# EAGLE design PowerDist (EAGLE 9.6.2)
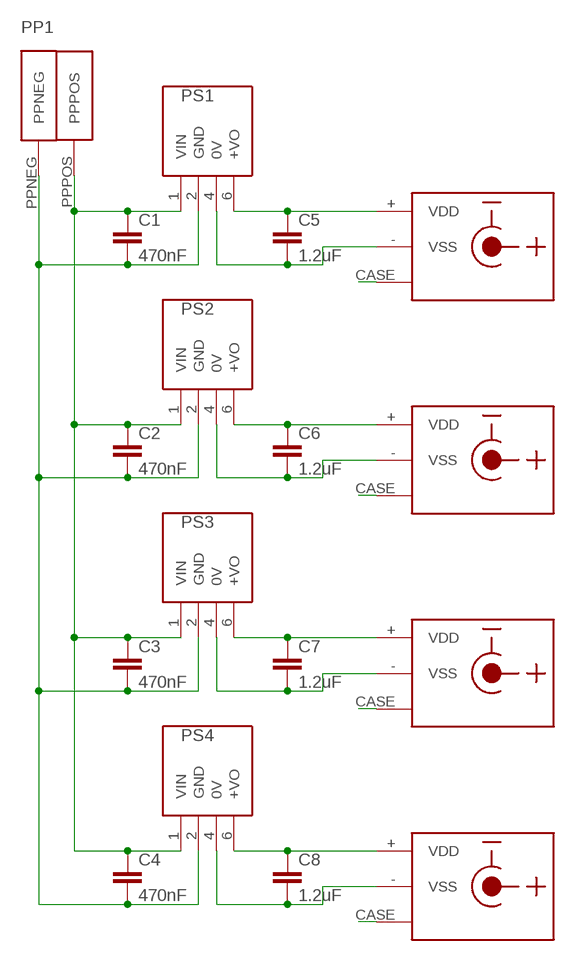
[diagram p0: schematic, sheet 1]

## Parts
C1  470nF  C5/2.5  [C5B2.5]
C2  470nF  C5/2.5  [C5B2.5]
C3  470nF  C5/2.5  [C5B2.5]
C4  470nF  C5/2.5  [C5B2.5]
C5  1.2uF  C2,5-3  [C2.5-3]
C6  1.2uF  C2,5-3  [C2.5-3]
C7  1.2uF  C2,5-3  [C2.5-3]
C8  1.2uF  C2,5-3  [C2.5-3]
PP1  POWER_POLES_WINGS  [POWERPOLE_PAIR_WINGS]
PS1  PRMCE1-S12-S15-S  [PRMCE1S12S15S]
PS2  PRMCE1-S12-S15-S  [PRMCE1S12S15S]
PS3  PRMCE1-S12-S15-S  [PRMCE1S12S15S]
PS4  PRMCE1-S12-S15-S  [PRMCE1S12S15S]
U$1  CUI_PJ-102A  [CUI_DCJACK_PCB]
U$2  CUI_PJ-102A  [CUI_DCJACK_PCB]
U$3  CUI_PJ-102A  [CUI_DCJACK_PCB]
U$4  CUI_PJ-102A  [CUI_DCJACK_PCB]

## Nets
CASE: U$1.CASE
CASE1: U$2.CASE
CASE2: U$3.CASE
CASE3: U$4.CASE
N$1: C1.1 C2.1 C3.1 C4.1 PP1.PPPOS PS1.1(VIN) PS2.1(VIN) PS3.1(VIN) PS4.1(VIN)
N$2: C1.2 C2.2 C3.2 C4.2 PP1.PPNEG PS1.2(GND) PS2.2(GND) PS3.2(GND) PS4.2(GND)
N$3: C5.1 PS1.6(+VO) U$1.+(VDD)
N$4: C6.1 PS2.6(+VO) U$2.+(VDD)
N$5: C7.1 PS3.6(+VO) U$3.+(VDD)
N$6: C8.1 PS4.6(+VO) U$4.+(VDD)
N$7: C5.2 PS1.4(0V) U$1.-(VSS)
N$8: C6.2 PS2.4(0V) U$2.-(VSS)
N$9: C7.2 PS3.4(0V) U$3.-(VSS)
N$10: C8.2 PS4.4(0V) U$4.-(VSS)

## Library data of the parts
C1-C8 = capacitor-wima:C: CAPACITOR naming: grid - package width
PP1 = cwParts:POWER_POLES_WINGS: Dual powerpoles for voltage supply with mounting wings.
PS1-PS4 = SamacSys_Parts:PRMCE1-S12-S15-S: Isolated DC/DC Converters dc-dc isolated 3k, 1 W, 11.4 12.6 Vdc input, 15 Vdc, 67 mA, single regulated output, SIP Source: Datasheet <https://www.cui.com/product/resource/pdf/prmce1-s.pdf>; DESCRIPTION: Isolated DC/DC Converters dc-dc isolated 3k, 1 W, 11.4 12.6 Vdc input, 15 Vdc, 67 mA, single regulated output, SIP; HEIGHT: 10.41mm; MANUFACTURER_NAME: CUI Inc.; MANUFACTURER_PART_NUMBER: PRMCE1-S12-S15-S; MOUSER_PART_NUMBER: 490-PRMCE1-S12-S15-S; MOUSER_PRICE-STOCK: https://www.mouser.co.uk/ProductDetail/CUI-Inc/PRMCE1-S12-S15-S?qs=7D1LtPJG0i3eC5LUP4Wtzw%3D%3D
U$1-U$4 = con-dc-jack:CUI_PJ-102A

## Board
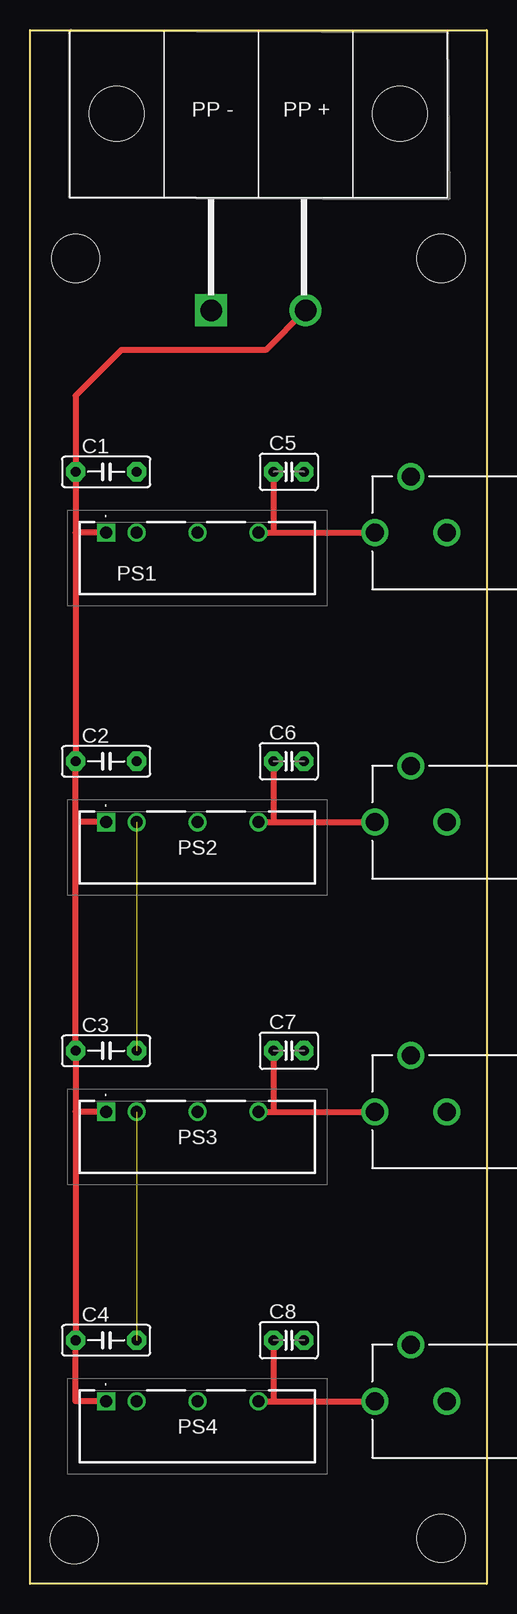
[diagram p1: board, top side]
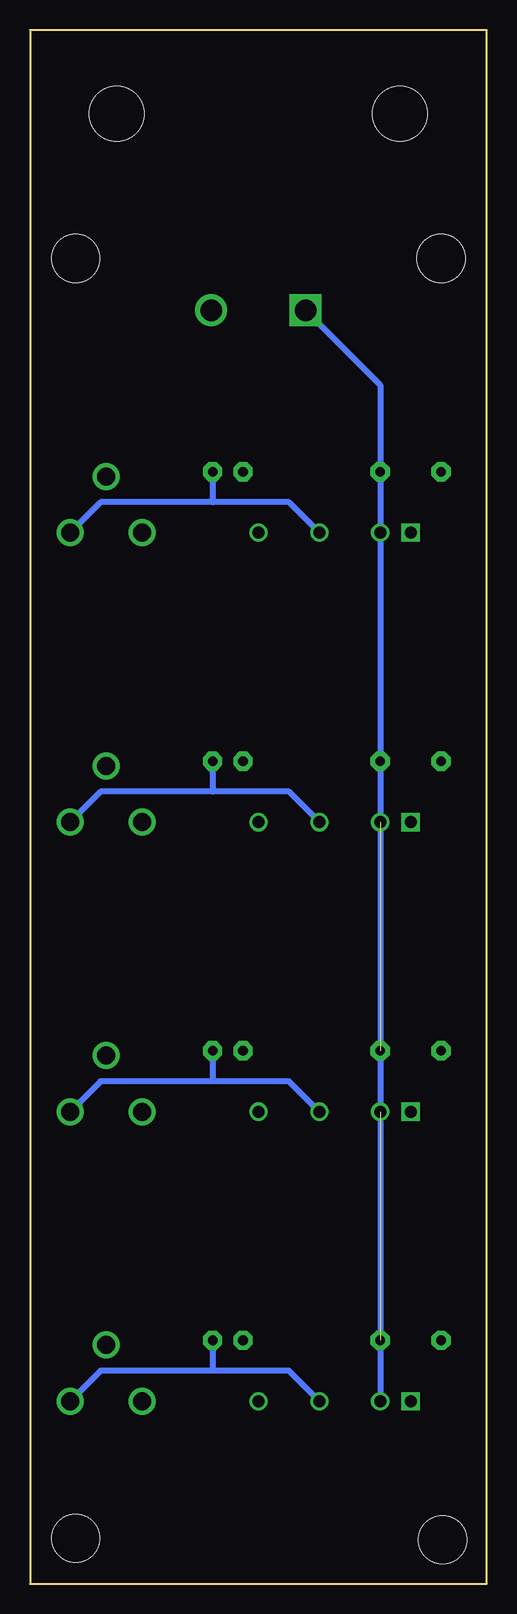
[diagram p2: board, bottom side, seen from below]

Size 38.1 x 129.54 mm. Coordinates in mm from the lower left corner, seen from the top.
Outline: 0,0 0,129.54 38.1,129.54 38.1,0 0,0
Copper layers (1*16): Top 0.035mm / dielectric 1.5mm / Bottom 0.035mm
Design rules "default": minimum track width 6mil, minimum drill 0.35mm, track to track 6mil, track to pad 6mil, pad to pad 6mil, via to via 6mil, smd to smd 6mil, copper to edge 40mil, drill to drill 6mil, minimum pad ring 10mil, minimum via ring 8mil, stop-mask expansion 4mil, vias tented up to drill 0mil, thermal gap 10mil
Holes 4 mm at 3.68,3.68 34.29,3.81 34.29,110.49 3.81,110.49

### Footprints (pad centres in the part's own frame; a part is rotated, then mirrored left to right if it is on the bottom)
C5B2.5 = drill 0.813 pad 1.6 octagon: 1 -2.54,0; 2 2.54,0
C2.5-3 = drill 0.813 pad 1.6 octagon: 1 -1.27,0; 2 1.27,0
POWERPOLE_PAIR_WINGS = drill 1.778 square: PPNEG -3.937,-23.368 | drill 1.778: PPPOS 3.937,-23.368 | hole 4.572: -11.811,-6.985; 11.811,-6.985
PRMCE1S12S15S = drill 1 pad 1.5 square: 1 0,0 | drill 1 pad 1.5: 2 2.54,0; 4 7.62,0; 6 12.7,0
CUI_DCJACK_PCB = drill 1.5: + -3,0; - 3,0; CASE 0,4.7

### Placement (x,y rotation side)
C1  6.35,92.71 0 top
C2  6.35,68.58 0 top
C3  6.35,44.45 0 top
C4  6.35,20.32 0 top
C5  21.59,92.71 0 top
C6  21.59,68.58 0 top
C7  21.59,44.45 0 top
C8  21.59,20.32 0 top
PP1  19.05,129.54 0 top
PS1  6.35,87.63 0 top
PS2  6.35,63.5 0 top
PS3  6.35,39.37 0 top
PS4  6.35,15.24 0 top
U$1  31.75,87.63 0 top
U$2  31.75,63.5 0 top
U$3  31.75,39.37 0 top
U$4  31.75,15.24 0 top

### Tracks (layer width: path | path; a pad name or v marks a point on that pad's centre or on a via)
N$1
  Top 0.508: PP1.PPPOS 19.68,102.87 7.62,102.87 3.81,99.06 C1.1 3.81,87.63 | 3.81,87.63 C2.1 3.81,63.5 | 3.81,63.5 C3.1 3.81,39.37 | 3.81,39.37 C4.1 3.81,15.24 PS4.1 | PS1.1 3.81,87.63 | PS2.1 3.81,63.5 | PS3.1 3.81,39.37
N$2  (2 unrouted)
  Bottom 0.508: PP1.PPNEG 8.89,99.95 C1.2 PS1.2 C2.2 PS2.2 C3.2 PS3.2 C4.2 PS4.2
N$3
  Top 0.508: PS1.6 20.32,87.63 | 20.32,87.63 U$1.+ | C5.1 20.32,87.63
N$4
  Top 0.508: PS2.6 20.32,63.5 | 20.32,63.5 U$2.+ | C6.1 20.32,63.5
N$5
  Top 0.508: PS3.6 20.32,39.37 | 20.32,39.37 U$3.+ | C7.1 20.32,39.37
N$6
  Top 0.508: PS4.6 20.32,15.24 | 20.32,15.24 U$4.+ | C8.1 20.32,15.24
N$7
  Bottom 0.508: PS1.4 16.51,90.17 22.86,90.17 | 22.86,90.17 32.21,90.17 U$1.- | C5.2 22.86,90.17
N$8
  Bottom 0.508: PS2.4 16.51,66.04 22.86,66.04 | 22.86,66.04 32.21,66.04 U$2.- | C6.2 22.86,66.04
N$9
  Bottom 0.508: PS3.4 16.51,41.91 22.86,41.91 | 22.86,41.91 32.21,41.91 U$3.- | C7.2 22.86,41.91
N$10
  Bottom 0.508: PS4.4 16.51,17.78 22.86,17.78 | 22.86,17.78 32.21,17.78 U$4.- | C8.2 22.86,17.78

### Text on the board
tDocu: 0V | 24V | 3kV Isolated 24VDC to 9VDC 1W / Regulated | 9V | 9V | 9V | 9V | chuck@whitmer.us